# EAGLE design zikcart-atc256-001 (EAGLE 6.4)
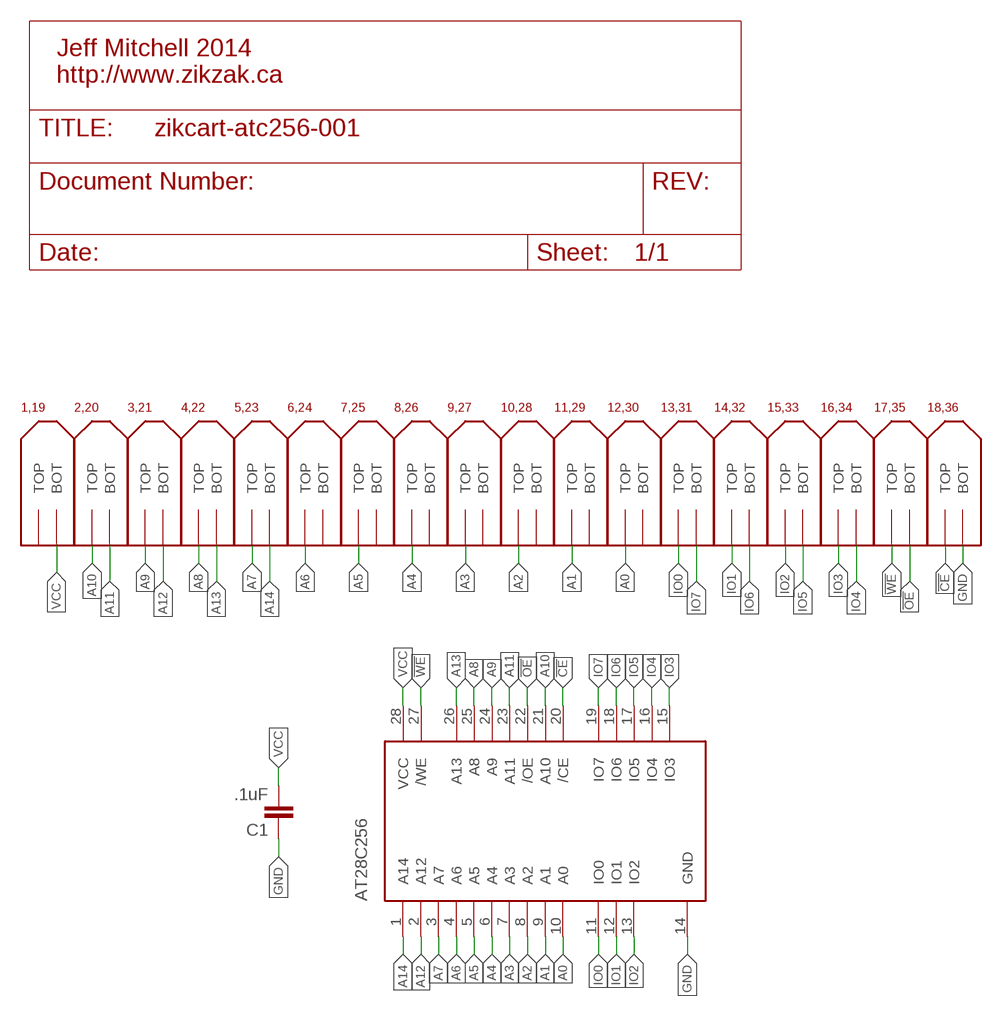
[diagram p0: schematic, sheet 1]

## Parts
1,19  ZIKZAKFINGERPAIR2X18  [ZIKZAKFINGERPAIR2X18]
2,20  ZIKZAKFINGERPAIR2X18  [ZIKZAKFINGERPAIR2X18]
3,21  ZIKZAKFINGERPAIR2X18  [ZIKZAKFINGERPAIR2X18]
4,22  ZIKZAKFINGERPAIR2X18  [ZIKZAKFINGERPAIR2X18]
5,23  ZIKZAKFINGERPAIR2X18  [ZIKZAKFINGERPAIR2X18]
6,24  ZIKZAKFINGERPAIR2X18  [ZIKZAKFINGERPAIR2X18]
7,25  ZIKZAKFINGERPAIR2X18  [ZIKZAKFINGERPAIR2X18]
8,26  ZIKZAKFINGERPAIR2X18  [ZIKZAKFINGERPAIR2X18]
9,27  ZIKZAKFINGERPAIR2X18  [ZIKZAKFINGERPAIR2X18]
10,28  ZIKZAKFINGERPAIR2X18  [ZIKZAKFINGERPAIR2X18]
11,29  ZIKZAKFINGERPAIR2X18  [ZIKZAKFINGERPAIR2X18]
12,30  ZIKZAKFINGERPAIR2X18  [ZIKZAKFINGERPAIR2X18]
13,31  ZIKZAKFINGERPAIR2X18  [ZIKZAKFINGERPAIR2X18]
14,32  ZIKZAKFINGERPAIR2X18  [ZIKZAKFINGERPAIR2X18]
15,33  ZIKZAKFINGERPAIR2X18  [ZIKZAKFINGERPAIR2X18]
16,34  ZIKZAKFINGERPAIR2X18  [ZIKZAKFINGERPAIR2X18]
17,35  ZIKZAKFINGERPAIR2X18  [ZIKZAKFINGERPAIR2X18]
18,36  ZIKZAKFINGERPAIR2X18  [ZIKZAKFINGERPAIR2X18]
AT28C256  AT28C256  [DIL28-6]
C1  .1uF  C-EU025-030X050  [C025-030X050]

## Nets
!CE!: 18,36.P$1(TOP) AT28C256.20(/CE)
!OE!: 17,35.P$2(BOT) AT28C256.22(/OE)
!WE!: 17,35.P$1(TOP) AT28C256.27(/WE)
A0: 12,30.P$1(TOP) AT28C256.10(A0)
A1: 11,29.P$1(TOP) AT28C256.9(A1)
A2: 10,28.P$1(TOP) AT28C256.8(A2)
A3: 9,27.P$1(TOP) AT28C256.7(A3)
A4: 8,26.P$1(TOP) AT28C256.6(A4)
A5: 7,25.P$1(TOP) AT28C256.5(A5)
A6: 6,24.P$1(TOP) AT28C256.4(A6)
A7: 5,23.P$1(TOP) AT28C256.3(A7)
A8: 4,22.P$1(TOP) AT28C256.25(A8)
A9: 3,21.P$1(TOP) AT28C256.24(A9)
A10: 2,20.P$1(TOP) AT28C256.21(A10)
A11: 2,20.P$2(BOT) AT28C256.23(A11)
A12: 3,21.P$2(BOT) AT28C256.2(A12)
A13: 4,22.P$2(BOT) AT28C256.26(A13)
A14: 5,23.P$2(BOT) AT28C256.1(A14)
GND: 18,36.P$2(BOT) AT28C256.14(GND) C1.1
IO0: 13,31.P$1(TOP) AT28C256.11(IO0)
IO1: 14,32.P$1(TOP) AT28C256.12(IO1)
IO2: 15,33.P$1(TOP) AT28C256.13(IO2)
IO3: 16,34.P$1(TOP) AT28C256.15(IO3)
IO4: 16,34.P$2(BOT) AT28C256.16(IO4)
IO5: 15,33.P$2(BOT) AT28C256.17(IO5)
IO6: 14,32.P$2(BOT) AT28C256.18(IO6)
IO7: 13,31.P$2(BOT) AT28C256.19(IO7)
VCC: 1,19.P$2(BOT) AT28C256.28(VCC) C1.2
Unconnected: 1,19.P$1(TOP) 6,24.P$2(BOT) 7,25.P$2(BOT) 8,26.P$2(BOT) 9,27.P$2(BOT) 10,28.P$2(BOT) 11,29.P$2(BOT) 12,30.P$2(BOT)

## Notes on the sheet
- Jeff Mitchell 2014
  http://www.zikzak.ca

## Library data of the parts
1,19 2,20 3,21 4,22 5,23 6,24 7,25 8,26 9,27 10,28 11,29 12,30 13,31 14,32 15,33 16,34 17,35 18,36 = skeezix:ZIKZAKFINGERPAIR2X18: Zikzak cartridge - male side - top and bottom finger pair; use 18 of them for a 2x18 edge connector
AT28C256 = skeezix:AT28C256
C1 = rcl:C-EU: CAPACITOR, European symbol

## Net classes
1 cart finger: width 2.54 mm

## Board
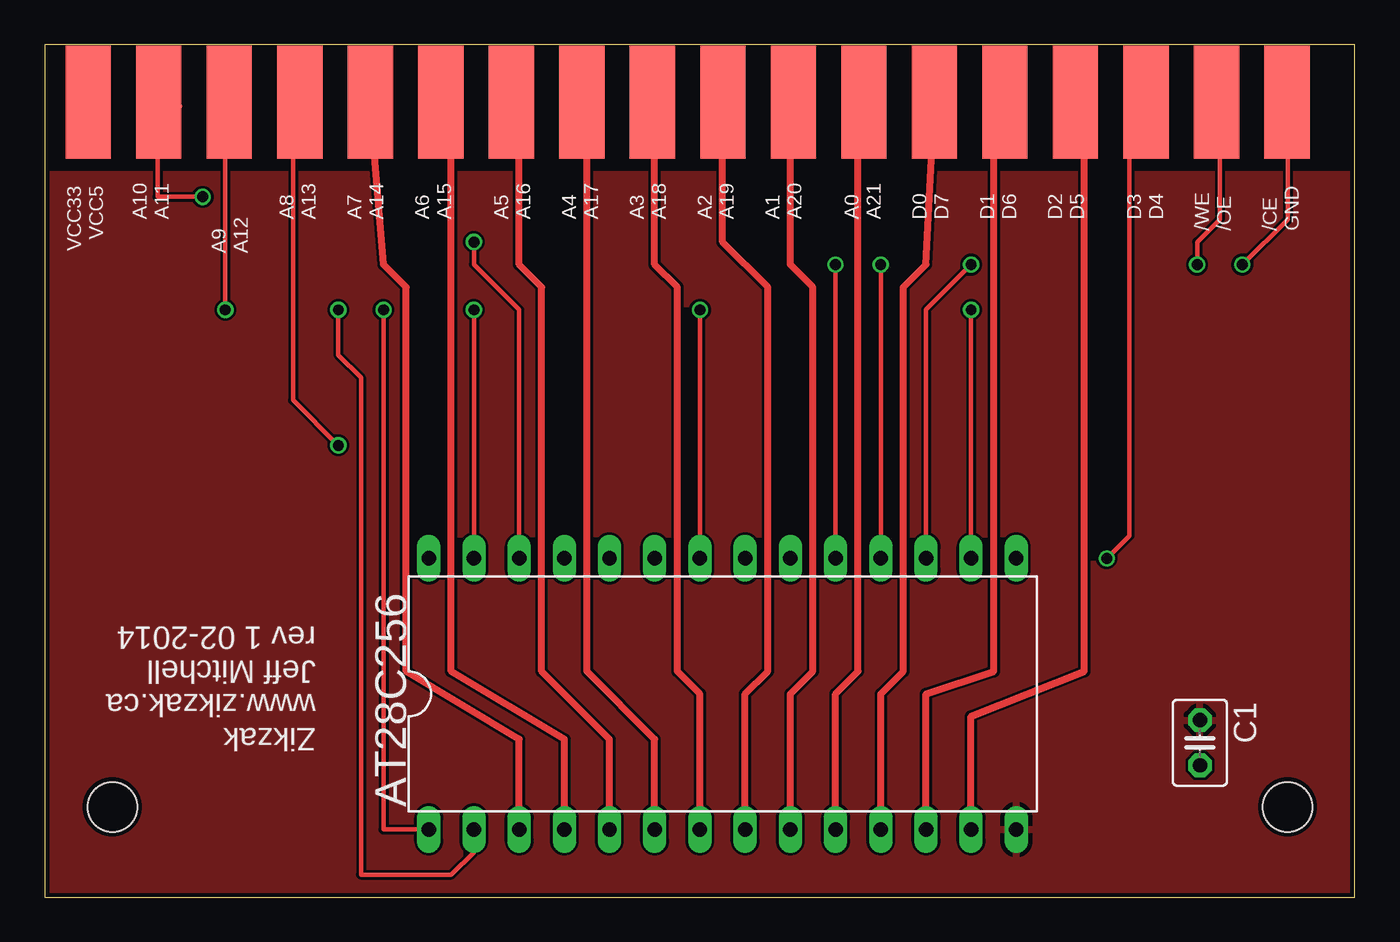
[diagram p1: board, top side]
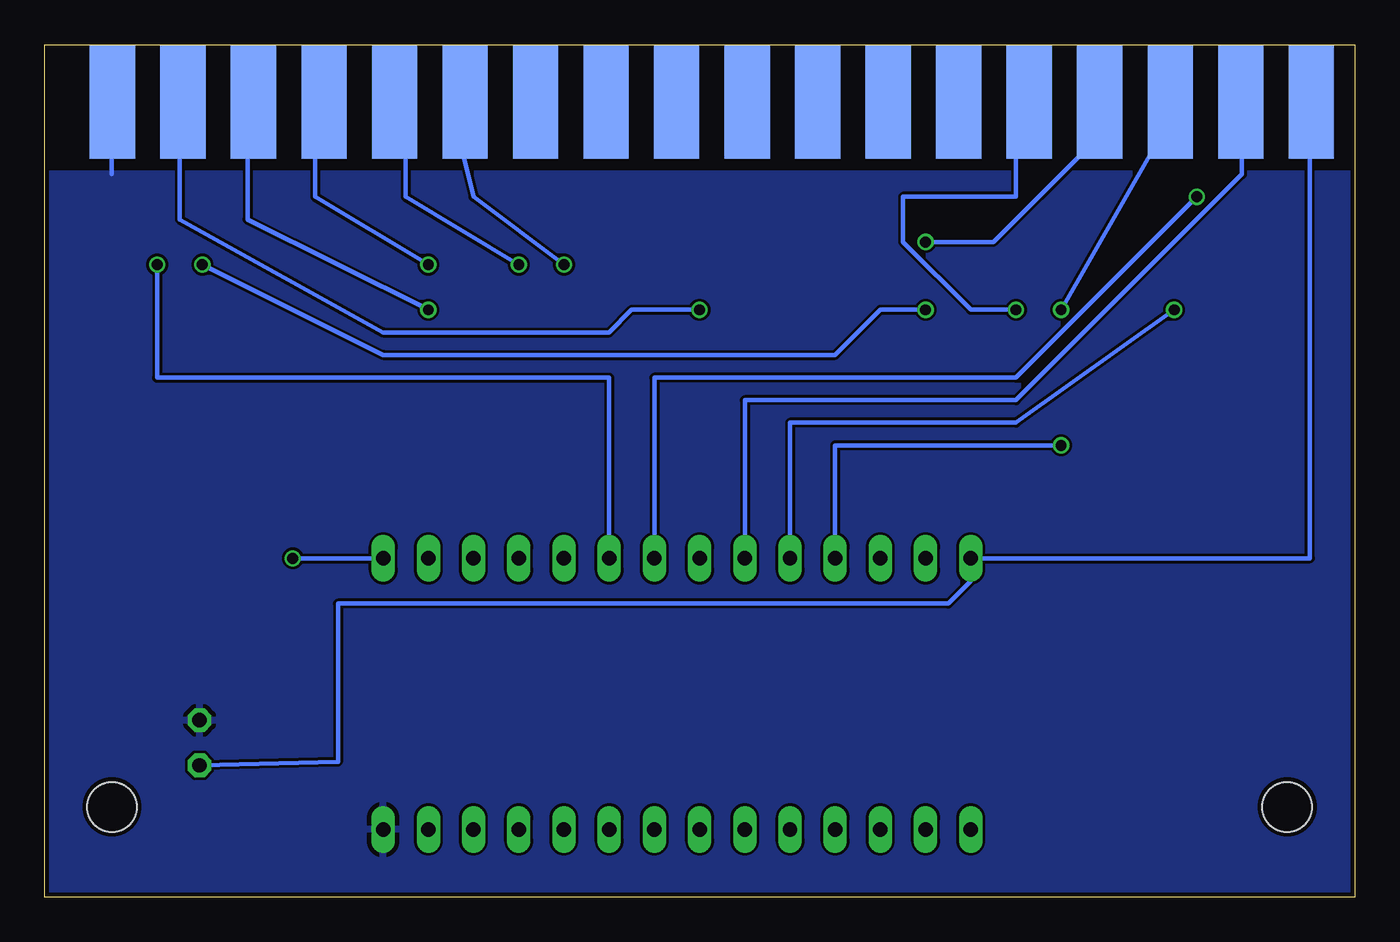
[diagram p2: board, bottom side, seen from below]

Size 73.64 x 47.93 mm. Coordinates in mm from the lower left corner, seen from the top.
Outline: 0,0 73.64,0 73.64,47.93 0,47.93 0,0
Copper layers (1*16): Top 0.035mm / dielectric 1.5mm / Bottom 0.035mm
Design rules "Elecrow_2-layer_eagle_rule": minimum track width 6mil, minimum drill 12mil, track to track 6mil, track to pad 6mil, pad to pad 6mil, via to via 6mil, smd to smd 0mil, copper to edge 10mil, drill to drill 10mil, minimum pad ring 10mil, minimum via ring 6mil, stop-mask expansion 2mil, vias tented up to drill 100mil, thermal gap 10mil
Holes 2.8 mm at 3.81,5.08 69.85,5.08

### Footprints (pad centres in the part's own frame; a part is rotated, then mirrored left to right if it is on the bottom)
ZIKZAKFINGERPAIR2X18 = smd 2.54 x 6.35: P$1 1.27,3.175 | smd 2.54 x 6.35 bottom: P$2 1.27,3.175
DIL28-6 = drill 0.813 long: 1 -16.51,-7.62; 2 -13.97,-7.62; 3 -11.43,-7.62; 4 -8.89,-7.62; 5 -6.35,-7.62; 6 -3.81,-7.62; 7 -1.27,-7.62; 8 1.27,-7.62; 9 3.81,-7.62; 10 6.35,-7.62; 11 8.89,-7.62; 12 11.43,-7.62; 13 13.97,-7.62; 14 16.51,-7.62; 15 16.51,7.62; 16 13.97,7.62; 17 11.43,7.62; 18 8.89,7.62; 19 6.35,7.62; 20 3.81,7.62; 21 1.27,7.62; 22 -1.27,7.62; 23 -3.81,7.62; 24 -6.35,7.62; 25 -8.89,7.62; 26 -11.43,7.62; 27 -13.97,7.62; 28 -16.51,7.62
C025-030X050 = drill 0.813 octagon: 1 -1.27,0; 2 1.27,0

### Placement (x,y rotation side)
1,19  1.19,41.51 0 top
2,20  5.15,41.51 0 top
3,21  9.11,41.51 0 top
4,22  13.08,41.51 0 top
5,23  17.04,41.51 0 top
6,24  21,41.51 0 top
7,25  24.96,41.51 0 top
8,26  28.93,41.51 0 top
9,27  32.89,41.51 0 top
10,28  36.85,41.51 0 top
11,29  40.81,41.51 0 top
12,30  44.78,41.51 0 top
13,31  48.74,41.51 0 top
14,32  52.7,41.51 0 top
15,33  56.66,41.51 0 top
16,34  60.62,41.51 0 top
17,35  64.59,41.51 0 top
18,36  68.55,41.51 0 top
AT28C256  38.1,11.43 0 top
C1  64.92,8.69 270 top

### Tracks (layer width: path | path; a pad name or v marks a point on that pad's centre or on a via)
!CE!  (via drill 0.61)
  Top 0.254: v67.31,35.56 69.85,38.1 69.85,44.45 18,36.P$1
  Bottom 0.254: AT28C256.20 41.91,29.21 67.31,29.21 v67.31,35.56
!OE!  (via drill 0.61)
  Top 0.254: v36.83,33.02 AT28C256.22
  Bottom 0.254: v36.83,33.02 40.64,33.02 41.91,31.75 54.61,31.75 66.04,38.1 66.04,41.91 64.77,44.45 17,35.P$2
!WE!  (via drill 0.61)
  Top 0.254: v24.13,33.02 AT28C256.27 | v64.77,35.56 64.77,36.83 66.04,38.1 66.04,43.18 64.77,44.45 17,35.P$1
  Bottom 0.254: v24.13,33.02 26.67,33.02 29.21,30.48 54.61,30.48 v64.77,35.56
A0
  Top 0.406: AT28C256.10 44.45,11.43 45.72,12.7 45.72,44.36 12,30.P$1
A1
  Top 0.406: AT28C256.9 41.91,11.43 43.18,12.7 43.18,34.29 41.91,35.56 41.91,44.52 11,29.P$1
A2
  Top 0.406: AT28C256.8 39.37,11.43 40.64,12.7 40.64,34.29 38.1,36.83 38.1,44.67 10,28.P$1
A3
  Top 0.406: AT28C256.7 36.83,11.43 35.56,12.7 35.56,34.29 34.29,35.56 34.29,44.56 9,27.P$1
A4
  Top 0.406: AT28C256.6 34.29,8.89 30.48,12.7 30.48,44.4 8,26.P$1
A5
  Top 0.406: AT28C256.5 31.75,8.89 27.94,12.7 27.94,34.29 26.67,35.56 26.67,44.25 7,25.P$1
A6
  Top 0.406: AT28C256.4 29.21,8.89 22.86,12.7 22.86,44.1 6,24.P$1
A7
  Top 0.406: AT28C256.3 26.67,8.89 20.32,12.7 20.32,34.29 19.05,35.56 5,23.P$1
A8  (via drill 0.61)
  Top 0.254: v16.51,25.4 13.97,27.94 13.97,41.91 15.24,43.18 15.24,44.45 4,22.P$1
  Bottom 0.254: AT28C256.25 29.21,25.4 v16.51,25.4
A9  (via drill 0.61)
  Top 0.254: v10.16,33.02 10.16,41.91 11.43,43.18 11.43,44.45 3,21.P$1
  Bottom 0.254: AT28C256.24 31.75,26.67 19.05,26.67 v10.16,33.02
A10  (via drill 0.61)
  Top 0.254: v8.89,39.37 6.35,39.37 6.35,43.18 7.62,44.45 2,20.P$1
  Bottom 0.254: AT28C256.21 39.37,29.21 19.05,29.21 v8.89,39.37
A11
  Bottom 0.254: AT28C256.23 34.29,27.94 19.05,27.94 6.35,40.64 6.35,44.45 2,20.P$2
A12  (via drill 0.61)
  Top 0.254: AT28C256.2 24.13,2.54 22.86,1.27 17.78,1.27 17.78,29.21 16.51,30.48 v16.51,33.02
  Bottom 0.254: v16.51,33.02 11.43,41.91 11.43,44.45 3,21.P$2
A13  (via drill 0.61)
  Top 0.254: AT28C256.26 26.67,33.02 24.13,35.56 v24.13,36.83
  Bottom 0.254: v24.13,36.83 20.32,36.83 15.24,41.91 15.24,44.45 4,22.P$2
A14  (via drill 0.61)
  Top 0.254: AT28C256.1 19.05,3.81 v19.05,33.02
  Bottom 0.254: v19.05,33.02 21.59,33.02 25.4,36.83 25.4,39.37 19.05,39.37 19.05,44.45 5,23.P$2
GND
  Bottom 0.254: 69.85,40.64 69.85,44.45 18,36.P$2
  pour Top: 0,40.64 73.66,40.64 73.66,0 0,0
  pour Bottom: 0,40.64 73.66,40.64 73.66,0 0,0
IO0
  Top 0.406: AT28C256.11 46.99,11.43 48.26,12.7 48.26,34.29 49.53,35.56 13,31.P$1
IO1
  Top 0.406: AT28C256.12 49.53,11.43 53.34,12.7 53.34,44.45 14,32.P$1
IO2
  Top 0.406: AT28C256.13 52.07,10.16 58.42,12.7 58.42,44.45 15,33.P$1
IO3  (via drill 0.61)
  Top 0.254: v59.69,19.05 60.96,20.32 60.96,44.45 16,34.P$1
  Bottom 0.254: v59.69,19.05 AT28C256.15
IO4  (via drill 0.61)
  Top 0.254: v52.07,33.02 AT28C256.16
  Bottom 0.254: v52.07,33.02 62.23,38.1 62.23,43.18 60.96,41.91 60.96,44.45 16,34.P$2
IO5  (via drill 0.61)
  Top 0.254: AT28C256.17 49.53,33.02 v52.07,35.56
  Bottom 0.254: v52.07,35.56 58.42,39.37 58.42,43.18 57.15,44.45 15,33.P$2
IO6  (via drill 0.61)
  Top 0.254: v46.99,35.56 AT28C256.18
  Bottom 0.254: v46.99,35.56 53.34,39.37 53.34,44.45 14,32.P$2
IO7  (via drill 0.61)
  Top 0.254: v44.45,35.56 AT28C256.19
  Bottom 0.254: v44.45,35.56 49.53,39.37 50.8,44.45 13,31.P$2
VCC
  Bottom 0.254: C1.2 57.15,7.62 57.15,16.51 22.86,16.51 21.59,17.78 AT28C256.28 2.54,19.05 2.54,44.45 1,19.P$2

### Text on the board
tPlace: VCC33 / VCC5 | A10 / A11 | A8 / A13 | A7 / A14 | A6 / A15 | A5 / A16 | A4 / A17 | A3 / A18 | A2 / A19 | A1 / A20 | A0 / A21 | D0 / D7 | D1 / D6 | D2 / D5 | D3 / D4 | /WE / /OE | /CE / GND | A9 / A12 | Zikzak / www.zikzak.ca / Jeff Mitchell / rev 1 02-2014